# EAGLE schematic circuit (EAGLE 7.1.0)
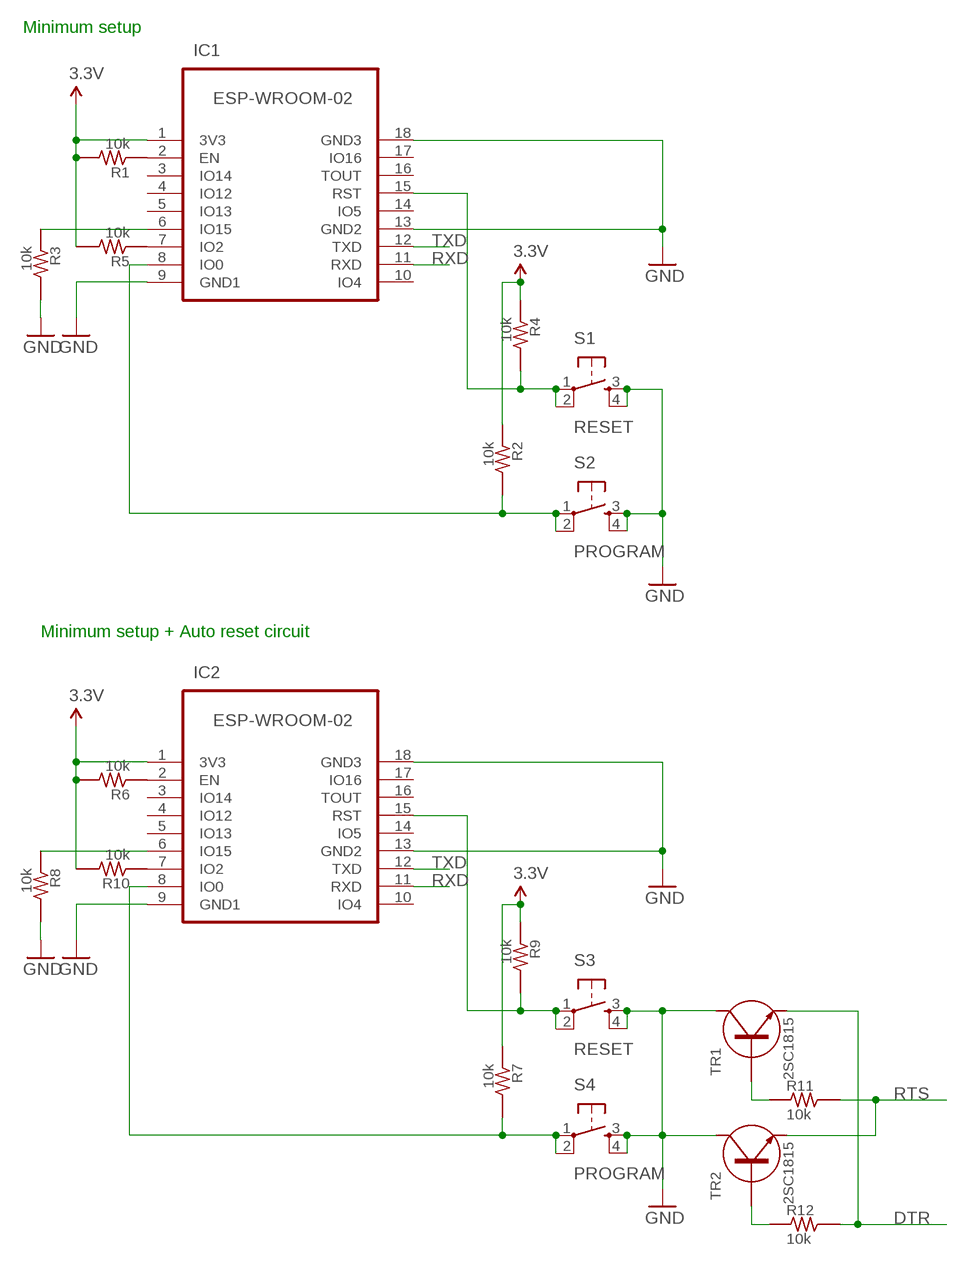
[diagram p0: schematic, sheet 1]

## Parts
IC1  ESP-WROOM-02  [ESP-WROOM-02]
IC2  ESP-WROOM-02  [ESP-WROOM-02]
R1  10k  R-1/4W-07.62  [1/4W-7.62H]
R2  10k  R-1/4W-07.62  [1/4W-7.62H]
R3  10k  R-1/4W-07.62  [1/4W-7.62H]
R4  10k  R-1/4W-07.62  [1/4W-7.62H]
R5  10k  R-1/4W-07.62  [1/4W-7.62H]
R6  10k  R-1/4W-07.62  [1/4W-7.62H]
R7  10k  R-1/4W-07.62  [1/4W-7.62H]
R8  10k  R-1/4W-07.62  [1/4W-7.62H]
R9  10k  R-1/4W-07.62  [1/4W-7.62H]
R10  10k  R-1/4W-07.62  [1/4W-7.62H]
R11  10k  R-1/4W-07.62  [1/4W-7.62H]
R12  10k  R-1/4W-07.62  [1/4W-7.62H]
S1  RESET  TAC_SWITCHPTH  [TACTILE-PTH]
S2  PROGRAM  TAC_SWITCHPTH  [TACTILE-PTH]
S3  RESET  TAC_SWITCHPTH  [TACTILE-PTH]
S4  PROGRAM  TAC_SWITCHPTH  [TACTILE-PTH]
TR1  2SC1815  TR-NPN-TO-92-ECB  [TO-92]
TR2  2SC1815  TR-NPN-TO-92-ECB  [TO-92]

## Nets
3.3V: IC1.1(3V3) IC2.1(3V3) R1.PAD2 R2.PAD1 R4.PAD1 R5.PAD2 R6.PAD2 R7.PAD1 R9.PAD1 R10.PAD2
DTR: R12.PAD2 TR1.1(E)
GND: IC1.9(GND1) IC1.13(GND2) IC1.18(GND3) IC2.9(GND1) IC2.13(GND2) IC2.18(GND3) R3.PAD2 R8.PAD2 S1.3 S1.4 S2.3 S2.4 S3.3 S3.4 S4.3 S4.4 TR1.2(C) TR2.2(C)
N$1: IC1.2(EN) R1.PAD1
N$2: IC1.7(IO2) R5.PAD1
N$3: IC1.6(IO15) R3.PAD1
N$4: IC2.2(EN) R6.PAD1
N$5: IC2.6(IO15) R8.PAD1
N$6: IC2.8(IO0) R7.PAD2 S4.1 S4.2
N$7: IC2.15(RST) R9.PAD2 S3.1 S3.2
N$8: IC1.8(IO0) R2.PAD2 S2.1 S2.2
N$9: IC1.15(RST) R4.PAD2 S1.1 S1.2
N$10: IC2.7(IO2) R10.PAD1
N$11: R11.PAD1 TR1.3(B)
N$12: R12.PAD1 TR2.3(B)
RTS: R11.PAD2 TR2.1(E)
RXD: IC1.11(RXD) IC2.11(RXD)
TXD: IC1.12(TXD) IC2.12(TXD)
Unconnected: IC1.3(IO14) IC1.4(IO12) IC1.5(IO13) IC1.10(IO4) IC1.14(IO5) IC1.16(TOUT) IC1.17(IO16) IC2.3(IO14) IC2.4(IO12) IC2.5(IO13) IC2.10(IO4) IC2.14(IO5) IC2.16(TOUT) IC2.17(IO16)

## Notes on the sheet
- Minimum setup
- Minimum setup + Auto reset circuit

## Library data of the parts
IC1 IC2 = my:ESP-WROOM-02: WiFi module - ESP-WROOM-02
R1-R12 = my:R-: RESISTOR Japanese symbol
S1-S4 = SparkFun-Electromechanical:TAC_SWITCH: Momentary Switch Button commonly used for reset or general input. Spark Fun Electronics SKU : COM-00097 SMT- SWCH-08247
TR1 TR2 = my:TR-NPN-: TRANSISTOR (Bipolar transistor) NPN type Japanese symbol